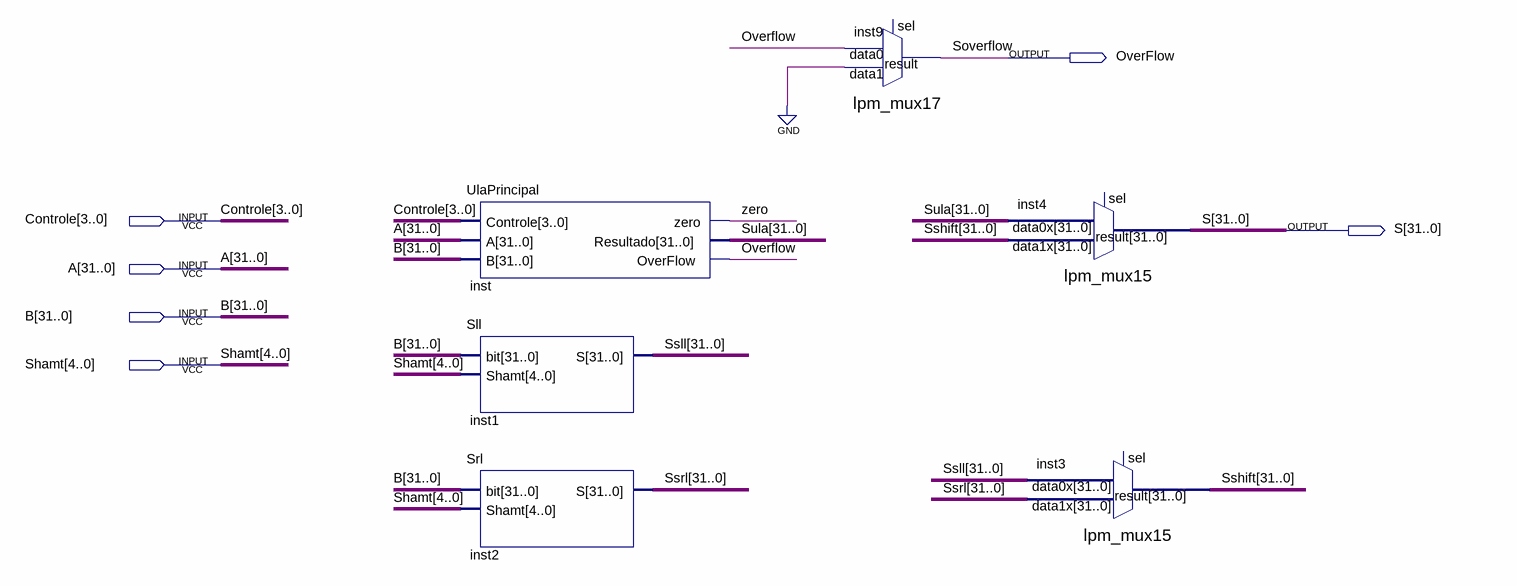
[diagram p0: schematic sheet]
// Quartus schematic ULA.bdf as structural Verilog: 6 symbols, 6 pins
module ULA (
  input  [3:0] Controle,
  input  [31:0] A,
  input  [31:0] B,
  input  [4:0] Shamt,
  output OverFlow,
  output [31:0] S
);

  wire zero;
  wire [31:0] Sshift, Ssll, Ssrl, Sula;

  UlaPrincipal inst (.Controle(Controle), .A(A), .B(B), .zero(zero), .Resultado(Sula), .OverFlow(OverFlow));
  Sll inst1 (.\bit (B), .Shamt(Shamt), .S(Ssll));
  Srl inst2 (.\bit (B), .Shamt(Shamt), .S(Ssrl));
  lpm_mux17 inst9 (.data1(1'b0), .data0(OverFlow), .result(OverFlow));  // open: sel
  lpm_mux15 inst4 (.data1x(Sshift), .data0x(Sula), .result(S));  // open: sel
  lpm_mux15 inst3 (.data1x(Ssrl), .data0x(Ssll), .result(Sshift));  // open: sel

  // Other names for the same wires on the sheet: Soverflow = OverFlow
endmodule
